# Altium schematic sheet jtag.SchDoc
size A
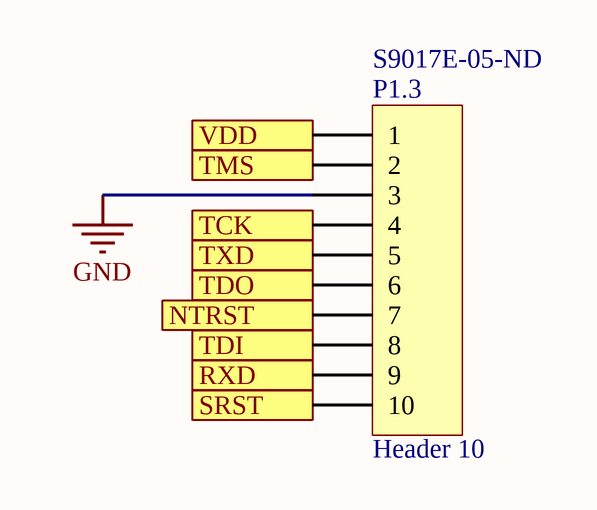
[diagram p0: jtag.SchDoc]

## Parts
P1.3  Header 10  Supplier Part Number 1: S9017E-05-ND  [GRPB052MWCN-RC]

## Ports
NTRST (out), RXD (out), SRST (out), TCK (out), TDI (out), TDO (in), TMS (out), TXD (in), VDD

## Nets
GND: P1.3.3
NTRST: P1.3.7 ; port NTRST
RXD: P1.3.9 ; port RXD
SRST: P1.3.10 ; port SRST
TCK: P1.3.4 ; port TCK
TDI: P1.3.8 ; port TDI
TDO: P1.3.6 ; port TDO
TMS: P1.3.2 ; port TMS
TXD: P1.3.5 ; port TXD
VDD: P1.3.1 ; port VDD

## Library data of the parts
P1.3 = Header 10: Header, 10-Pin; ComponentLink1URL: http://cnctech.us/pdfs/3220-XX-0100-00.pdf; ComponentLink1Description: http://cnctech.us/pdfs/3220-XX-0100-00.pdf; Supplier 1: Digi-Key